# EAGLE design teensy-cv (EAGLE 7.4.0)
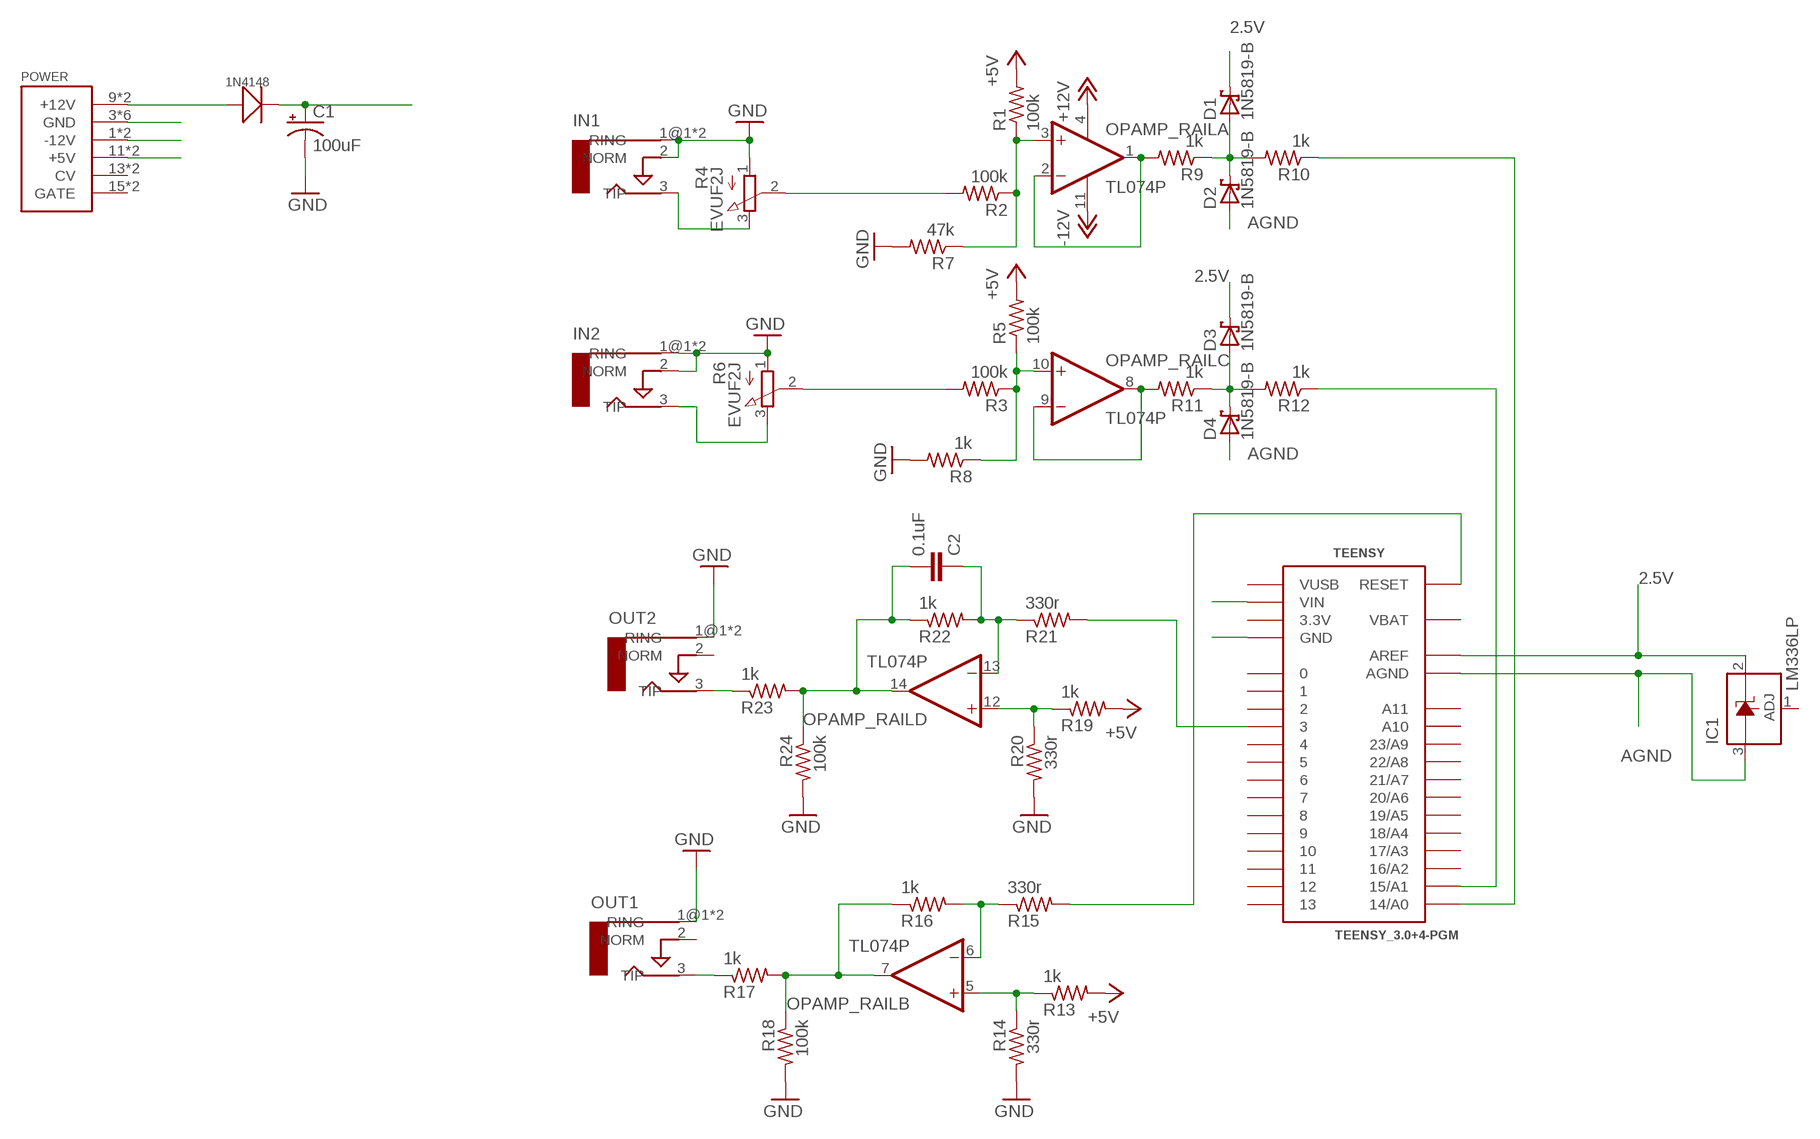
[diagram p0: schematic, sheet 1]

## Parts
1N4148  DIODE'1N4148'  [DO-35]
C1  100uF  CPOL-USE2-4  [E2-4]
C2  0.1uF  C5/3  [C5B3]
D1  1N5819-B  [DO41-7.6]
D2  1N5819-B  [DO41-7.6]
D3  1N5819-B  [DO41-7.6]
D4  1N5819-B  [DO41-7.6]
IC1  LM336LP  [TO92]
IN1  AUDIO-JACKERTHENVAR  [ERTHENVAR-JACK]
IN2  AUDIO-JACKERTHENVAR  [ERTHENVAR-JACK]
OPAMP_RAIL  TL074P  [DIL14]
OUT1  AUDIO-JACKERTHENVAR  [ERTHENVAR-JACK]
OUT2  AUDIO-JACKERTHENVAR  [ERTHENVAR-JACK]
POWER  POWER  [POWER_16]
R1  100k  R-US_0207/7  [0207/7]
R2  100k  R-US_0207/7  [0207/7]
R3  100k  R-US_0207/7  [0207/7]
R4  EVUF2J  [EVUFXJ]
R5  100k  R-US_0207/7  [0207/7]
R6  EVUF2J  [EVUFXJ]
R7  47k  R-US_0207/7  [0207/7]
R8  1k  R-US_0207/7  [0207/7]
R9  1k  R-US_0207/7  [0207/7]
R10  1k  R-US_0207/7  [0207/7]
R11  1k  R-US_0207/7  [0207/7]
R12  1k  R-US_0207/7  [0207/7]
R13  1k  R-US_0207/7  [0207/7]
R14  330r  R-US_0207/7  [0207/7]
R15  330r  R-US_0207/7  [0207/7]
R16  1k  R-US_0207/7  [0207/7]
R17  1k  R-US_0207/7  [0207/7]
R18  100k  R-US_0207/7  [0207/7]
R19  1k  R-US_0207/7  [0207/7]
R20  330r  R-US_0207/7  [0207/7]
R21  330r  R-US_0207/7  [0207/7]
R22  1k  R-US_0207/7  [0207/7]
R23  1k  R-US_0207/7  [0207/7]
R24  100k  R-US_0207/7  [0207/7]
TEENSY  TEENSY_3.0+4-PGM  [TEENSY_3.0+4-PGM]

## Nets
1N4148: 1N4148.A(+) POWER.9(+12V) POWER.10(+12V)
2.5V: D1.C D3.C IC1.2(C) TEENSY.AREF
+5V: POWER.11(+5V) POWER.12(+5V) R1.2 R5.2 R13.2 R19.2 TEENSY.VIN
+12V: 1N4148.C(-) C1.+ OPAMP_RAIL.4(P:V+)
-12V: OPAMP_RAIL.11(P:V-) POWER.1(-12V) POWER.2(-12V)
AGND: D2.A D4.A IC1.3(A) TEENSY.AGND
GND: C1.- IN1.1@1(RING) IN1.1@2(RING) IN1.2(NORM) IN2.1@1(RING) IN2.1@2(RING) IN2.2(NORM) OUT1.1@1(RING) OUT1.1@2(RING) OUT2.1@1(RING) OUT2.1@2(RING) POWER.3(GND) POWER.4(GND) POWER.5(GND) POWER.6(GND) POWER.7(GND) POWER.8(GND) R4.1(A) R6.1(A) R7.2 R8.2 R14.2 R18.2 R20.2 R24.2 TEENSY.GND TEENSY.GND1(GND)
N$1: R2.2 R4.2(S)
N$2: OPAMP_RAIL.1(A:OUT) OPAMP_RAIL.2(A:-IN) R9.2
N$3: OPAMP_RAIL.3(A:+IN) R1.1 R2.1 R7.1
N$4: IN1.3(TIP) R4.3(E)
N$5: D1.A D2.C R9.1 R10.2
N$6: R10.1 TEENSY.14/A0
N$7: IN2.3(TIP) R6.3(E)
N$8: R3.2 R6.2(S)
N$9: OPAMP_RAIL.10(C:+IN) R3.1 R5.1 R8.1
N$10: OPAMP_RAIL.8(C:OUT) OPAMP_RAIL.9(C:-IN) R11.2
N$13: D3.A D4.C R11.1 R12.2
N$14: R12.1 TEENSY.15/A1
N$15: OPAMP_RAIL.5(B:+IN) R13.1 R14.1
N$16: OPAMP_RAIL.6(B:-IN) R15.1 R16.2
N$17: OPAMP_RAIL.7(B:OUT) R16.1 R17.2 R18.1
N$18: OPAMP_RAIL.12(D:+IN) R19.1 R20.1
N$19: R15.2 TEENSY.RESET
N$20: OUT1.3(TIP) R17.1
N$21: C2.1 OPAMP_RAIL.13(D:-IN) R21.1 R22.2
N$22: C2.2 OPAMP_RAIL.14(D:OUT) R22.1 R23.2 R24.1
N$23: R21.2 TEENSY.3
N$24: OUT2.3(TIP) R23.1
Unconnected: IC1.1(ADJ) OUT1.2(NORM) OUT2.2(NORM) POWER.13(CV) POWER.14(CV) POWER.15(GATE) POWER.16(GATE) TEENSY.0 TEENSY.1 TEENSY.2 TEENSY.4 TEENSY.5 TEENSY.6 TEENSY.7 TEENSY.8 TEENSY.9 TEENSY.10 TEENSY.11 TEENSY.12 TEENSY.13 TEENSY.16/A2 TEENSY.17/A3 TEENSY.18/A4 TEENSY.19/A5 TEENSY.20/A6 TEENSY.21/A7 TEENSY.22/A8 TEENSY.23/A9 TEENSY.A10 TEENSY.A11

## Power pins joined to a net without a drawn wire
3.3V: TEENSY.3.3V TEENSY.3.3V1(3.3V)
VBAT: TEENSY.VBAT
VUSB: TEENSY.VUSB

## Library data of the parts
1N4148 = Seeed-OPL-Diode:DIODE*
C1 = rcl:CPOL-US: POLARIZED CAPACITOR, American symbol
C2 = capacitor-wima:C: CAPACITOR naming: grid - package width
D1-D4 = diode:1N581*: 1.0A SCHOTTKY BARRIER RECTIFIER Source: http://www.diodes.com/datasheets/ds23001.pdf
IC1 = linear:LM336: 2.5-V INTEGRATED REFERENCE CIRCUITS LM236 Source: http://focus.ti.com/lit/ds/symlink/lm336-2.5.pdf
IN1 IN2 OUT1 OUT2 = erthenvar:AUDIO-JACK: Switching Mono 3.5mm Audio Jack from Erthenvar.
OPAMP_RAIL = linear:TL074: OP AMP
POWER = eurorack:POWER
R1-R3 R5 R7-R24 = resistor:R-US_: RESISTOR, American symbol
R4 R6 = pot:EVU: 9 mm Square Rotary Potentiometers Source: Panasonic
TEENSY = Teensy3.0:TEENSY_3.0+4-PGM: Teensy 3.0 board outline identical to '+4' version except that the PGM pin has been omitted. See 'AllAnalogPins" and 'AllPins' packages for additional pin holes, as needed. The 'Basic' package has fewer pins

## Board
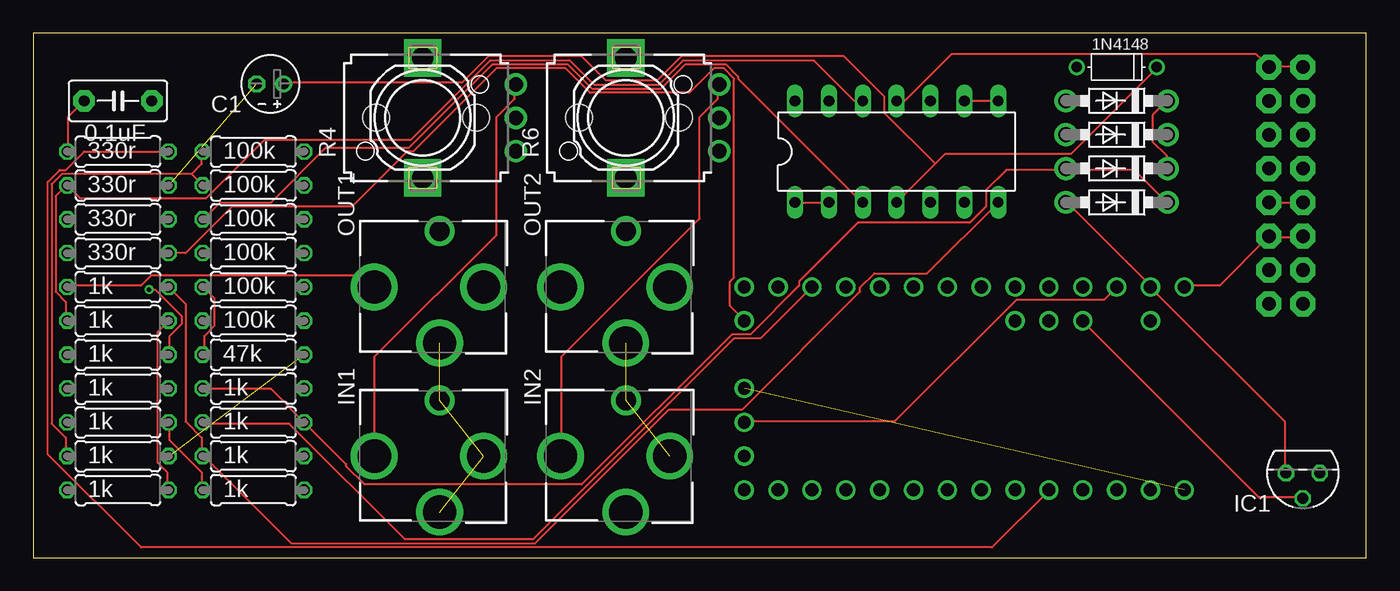
[diagram p1: board, top side]
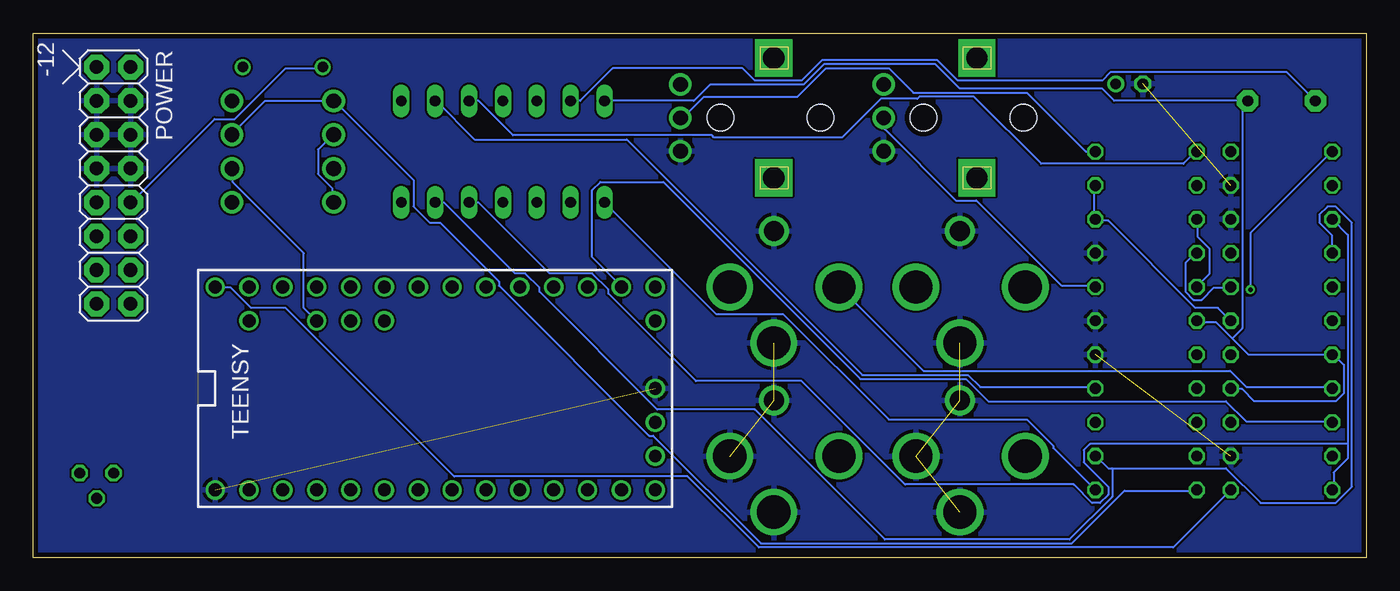
[diagram p2: board, bottom side, seen from below]

Size 100 x 39.36 mm. Coordinates in mm from the lower left corner, seen from the top.
Outline: 0,0 100,0 100,39.36 0,39.36 0,0
Copper layers (1*16): Top 0.0356mm / dielectric 1.5011mm / Bottom 0.0356mm
Design rules "LaenPCBOrder": minimum track width 6mil, minimum drill 13mil, track to track 6mil, track to pad 6mil, pad to pad 6mil, via to via 6mil, smd to smd 6mil, copper to edge 15mil, drill to drill 6mil, minimum pad ring 7mil, minimum via ring 7mil, stop-mask expansion 3mil, vias tented up to drill 0mil, thermal gap 10mil

### Footprints (pad centres in the part's own frame; a part is rotated, then mirrored left to right if it is on the bottom)
DO-35 = drill 0.8: A -3,0; C 3,0
E2-4 = drill 0.813 pad 1.27: + -1.016,0 | drill 0.813 pad 1.27 octagon: - 1.016,0
C5B3 = drill 0.813 pad 1.6 octagon: 1 -2.54,0; 2 2.54,0
DO41-7.6 = drill 1.1 pad 1.7: A 3.81,0; C -3.81,0
TO92 = drill 0.813 octagon: 1 -1.27,0; 2 0,1.905; 3 1.27,0
ERTHENVAR-JACK = drill 2.5: 1@1 -4.2,0; 2 0,-3.3; 3 0,4.9 | drill 1.5: 1@2 4.2,0
DIL14 = drill 0.813 long: 1 -7.62,-3.81; 2 -5.08,-3.81; 3 -2.54,-3.81; 4 0,-3.81; 5 2.54,-3.81; 6 5.08,-3.81; 7 7.62,-3.81; 8 7.62,3.81; 9 5.08,3.81; 10 2.54,3.81; 11 0,3.81; 12 -2.54,3.81; 13 -5.08,3.81; 14 -7.62,3.81
POWER_16 = drill 1.016 pad 1.88 octagon: 1 -6.35,-1.27; 2 -6.35,1.27; 3 -3.81,-1.27; 4 -3.81,1.27; 5 -1.27,-1.27; 6 -1.27,1.27; 7 1.27,-1.27; 8 1.27,1.27; 9 3.81,-1.27; 10 3.81,1.27; 11 6.35,-1.27; 12 6.35,1.27; 13 8.89,-1.27; 14 8.89,1.27; 15 11.43,-1.27; 16 11.43,1.27
0207/7 = drill 0.813 octagon: 1 -3.81,0; 2 3.81,0
EVUFXJ = drill 1.1 pad 1.676: 1 -2.5,-7; 2 0,-7; 3 2.5,-7 | drill 1.6 pad 2.8 square: M1 4.5,0; M2 -4.5,0 | hole 2: 0,3.5; 0,-4
TEENSY_3.0+4-PGM = drill 0.965: 0 -7.62,13.97; 1 -7.62,11.43; 2 -7.62,8.89; 3 -7.62,6.35; 3.3V 7.62,11.43; 3.3V1 -2.54,-16.51; 4 -7.62,3.81; 5 -7.62,1.27; 6 -7.62,-1.27; 7 -7.62,-3.81; 8 -7.62,-6.35; 9 -7.62,-8.89; 10 -7.62,-11.43; 11 -7.62,-13.97; 12 -7.62,-16.51; 13 7.62,-16.51; 14/A0 7.62,-13.97; 15/A1 7.62,-11.43; 16/A2 7.62,-8.89; 17/A3 7.62,-6.35; 18/A4 7.62,-3.81; 19/A5 7.62,-1.27; 20/A6 7.62,1.27; 21/A7 7.62,3.81; 22/A8 7.62,6.35; 23/A9 7.62,8.89; A10 5.08,6.35; A11 5.08,3.81; AGND 7.62,13.97; AREF 5.08,8.89; GND -7.62,16.51; GND1 0,-16.51; RESET 5.08,-16.51; VBAT -5.08,-16.51; VIN 7.62,16.51; VUSB 5.08,13.97

### Placement (x,y rotation side)
1N4148  81.28,36.83 0 top
C1  17.78,35.56 180 top
C2  6.35,34.29 0 top
D1  81.28,34.29 180 top
D2  81.28,31.75 180 top
D3  81.28,29.21 180 top
D4  81.28,26.67 180 top
IC1  95.25,6.35 180 top
IN1  30.48,7.62 90 top
IN2  44.45,7.62 90 top
OPAMP_RAIL  64.77,30.48 0 top
OUT1  30.48,20.32 90 top
OUT2  44.45,20.32 90 top
POWER  93.98,30.48 270 bottom
R1  16.51,25.4 0 top
R2  16.51,20.32 0 top
R3  16.51,30.48 0 top
R4  29.21,33.02 90 top
R5  16.51,27.94 0 top
R6  44.45,33.02 90 top
R7  16.51,15.24 0 top
R8  6.35,7.62 0 top
R9  16.51,5.08 0 top
R10  6.35,10.16 0 top
R11  16.51,12.7 0 top
R12  16.51,10.16 0 top
R13  6.35,5.08 0 top
R14  6.35,25.4 0 top
R15  6.35,22.86 0 top
R16  16.51,7.62 0 top
R17  6.35,20.32 0 top
R18  16.51,22.86 0 top
R19  6.35,17.78 0 top
R20  6.35,27.94 0 top
R21  6.35,30.48 0 top
R22  6.35,15.24 0 top
R23  6.35,12.7 0 top
R24  16.51,17.78 0 top
TEENSY  69.85,12.7 90 bottom

### Tracks (layer width: path | path; a pad name or v marks a point on that pad's centre or on a via)
1N4148
  Top 0.152: POWER.10 POWER.9
  Bottom 0.152: 1N4148.A 78.33,36.73 81.08,36.73 84.89,32.92 86.41,32.92 92.66,26.67 POWER.10
2.5V
  Top 0.152: D3.C 85.04,29.26 85.04,30.18 83.97,31.24 83.97,33.22 85.04,34.29 D1.C | IC1.2 95.25,4.57 91.9,4.57 78.79,17.68 TEENSY.AREF
  Bottom 0.152: TEENSY.AREF 79.7,18.75 79.7,22.86 85.04,28.19 85.04,29.11 D3.C
3.3V
  Top 0.152: TEENSY.3.3V 80.31,19.36 73.76,19.36 64.62,10.21 53.34,10.21 TEENSY.3.3V1
+5V
  Top 0.152: TEENSY.VIN 86.41,20.42 89,20.42 POWER.12 92.81,24.08 95.25,24.08 POWER.11 | R19.2 9.3,16.92 9.3,7.16 10.06,6.4 10.06,5.18 R13.2
  Bottom 0.152: R5.2 20.42,27.89 20.42,25.45 R1.2 20.27,25.3 19.36,25.3 12.8,18.75 11.12,18.75 R19.2 | R13.2 14.48,0.76 45.57,0.76 50.9,6.1 68.43,6.1 81.08,18.75 83.67,18.75 85.19,20.27 86.26,20.27 TEENSY.VIN
+12V
  Top 0.152: OPAMP_RAIL.4 67.67,29.57 | 67.67,29.57 68.43,30.33 77.88,30.33 84.28,36.73 1N4148.C | 67.67,29.57 63.86,33.38 63.86,34.59 60.81,37.64 48.62,37.64 46.79,35.81 42.98,35.81 41.15,37.64 34.14,37.64 32.16,35.66 18.9,35.66 C1.+
-12V
  Top 0.152: OPAMP_RAIL.11 65.38,34.29 68.89,37.8 91.75,37.8 POWER.2 92.81,36.88 95.25,36.88 POWER.1
AGND
  Top 0.152: IC1.3 93.88,6.4 93.88,10.21 83.82,20.27 TEENSY.AGND 83.82,20.42 77.57,26.67 D4.A
  Bottom 0.152: D4.A 77.57,26.67 77.57,27.74 78.64,28.8 78.64,30.63 77.57,31.7 D2.A
GND  (8 unrouted)
  pour Bottom: 0,0 0,40.64 100.33,40.64 100.33,0
N$1
  Bottom 0.152: R2.2 20.42,20.42 22.86,20.42 29.26,26.82 30.79,26.82 36.12,32.16 36.12,32.92 R4.2
N$2
  Top 0.152: OPAMP_RAIL.1 OPAMP_RAIL.2
  Bottom 0.152: R9.2 23.47,8.23 23.47,8.38 25.45,10.36 35.81,10.36 43.74,18.29 48.77,18.29 OPAMP_RAIL.1
N$3
  Top 0.152: R7.1 12.8,15.24 12.8,16.61 13.56,17.37 13.56,19.51 12.8,20.27 R2.1 | OPAMP_RAIL.3 62.18,26.67 52.88,35.97 52.88,36.12 51.97,37.03 48.92,37.03 47.09,35.2 41.91,35.2 40.08,37.03 34.44,37.03 28.19,30.79 21.95,30.79 17.83,26.67 14.02,26.67 12.8,25.45 R1.1
  Bottom 0.152: R1.1 12.65,25.3 12.65,24.08 11.73,23.16 11.73,21.34 12.65,20.42 R2.1
N$4
  Top 0.152: R4.3 36.12,35.51 36.12,34.44 34.75,33.07 34.75,24.23 25.6,15.09 25.6,7.62 IN1.3
N$5
  Top 0.152: R9.1 12.65,5.18 12.65,6.4 10.21,8.84 10.21,10.06 R10.2
  Bottom 0.152: D2.C 85.04,31.85 82.6,34.29 D1.A 77.42,34.29 71.48,28.35 71.48,26.36 70.26,25.15 69.49,25.15 65.08,20.73 65.08,20.42 53.8,9.14 53.49,9.14 45.41,1.07 22.1,1.07 18.14,5.03 12.8,5.03 R9.1
N$6
  Bottom 0.152: R10.1 2.59,10.21 8.99,10.21 10.52,11.73 28.35,11.73 30.02,13.41 37.95,13.41 52.73,28.19 57.45,28.19 58.06,27.58 58.06,22.55 55.93,20.42 TEENSY.14/A0
N$7
  Top 0.152: R6.3 51.36,35.51 51.36,34.44 49.99,33.07 49.99,25.45 39.62,15.09 39.62,7.62 IN2.3
N$8
  Bottom 0.152: R3.2 21.03,30.48 25.45,34.9 33.98,34.9 35.81,36.73 40.54,36.73 42.67,34.59 49.68,34.59 51.36,32.92 R6.2
N$9
  Top 0.152: 11.89,28.8 2.13,28.8 1.37,28.04 1.37,10.06 2.44,8.99 2.44,7.62 R8.1 | 11.89,28.8 12.65,28.04 R5.1 | 11.89,28.8 12.65,29.57 12.65,30.48 R3.1
  Bottom 0.152: OPAMP_RAIL.10 66.6,34.29 64.01,31.7 49.07,31.7 48.92,31.55 39.32,31.55 36.42,34.44 33.68,34.44 33.53,34.59 29.41,34.59 24.38,29.57 13.72,29.57 12.8,30.48 R3.1
N$10
  Top 0.152: OPAMP_RAIL.9 OPAMP_RAIL.8
  Bottom 0.152: R11.2 20.42,12.8 28.96,12.8 29.87,13.72 37.8,13.72 55.47,31.39 66.9,31.39 69.8,34.29 OPAMP_RAIL.9
N$13
  Top 0.152: R11.1 12.8,12.65 17.83,12.65 R12.2 23.47,7.01 23.47,6.86 24.84,5.49 41.15,5.49 52.43,16.76 53.8,16.76 57.45,20.42 57.45,20.73 61.87,25.15 70.26,25.15 71.48,26.36 71.48,27.58 73,29.11 77.42,29.11 D3.A 77.57,29.11 82.6,29.11 85.04,26.67 D4.C
N$14
  Top 0.152: TEENSY.15/A1 54.56,16.46 52.58,16.46 37.49,1.37 27.89,1.37 19.2,10.06 12.8,10.06 R12.1
N$15
  Bottom 0.152: 1.37,8.53 1.37,24.23 R14.1 | 1.37,8.53 1.37,7.47 2.44,6.4 2.44,5.18 R13.1 | OPAMP_RAIL.5 66.6,26.67 61.27,21.34 58.06,21.34 56.84,20.12 56.84,19.81 50.29,13.26 42.37,13.26 34.59,5.49 21.95,5.49 20.57,4.12 19.96,4.12 19.36,4.72 19.36,5.33 21.18,7.16 21.18,8.08 20.73,8.53 1.37,8.53
N$16
  Bottom 0.152: 19.05,6.71 19.36,6.71 20.27,7.62 R16.2 | 19.05,6.71 10.52,6.71 7.92,4.12 2.29,4.12 1.07,5.33 1.07,25.15 2.29,26.36 2.9,26.36 3.5,25.76 3.5,25.15 2.59,24.23 2.59,22.86 R15.1 | OPAMP_RAIL.6 69.19,26.67 63.86,21.34 63.09,21.34 62.03,20.27 62.03,19.96 53.19,11.12 45.87,11.12 36.12,1.37 22.25,1.37 19.05,4.57 19.05,6.71
N$17
  Top 0.152: R17.2 11.43,19.05 11.43,10.21 12.65,8.99 12.65,7.62 R16.1 12.8,7.62 19.36,1.07 37.64,1.07 47.7,11.12 53.19,11.12 62.03,19.96 62.03,20.27 63.09,21.34 67.06,21.34 OPAMP_RAIL.7
  Bottom 0.152: R17.2 10.21,20.27 11.43,20.27 12.34,19.36 12.95,19.36 13.56,19.96 13.56,22.1 12.8,22.86 R18.1
N$18
  Top 0.152: R19.1 2.44,17.83 2.44,19.2 1.68,19.96 1.68,27.13 2.44,27.89 R20.1 3.5,26.98 12.95,26.98 17.37,31.39 28.35,31.39 34.29,37.34 40.23,37.34 42.06,35.51 46.94,35.51 48.77,37.34 58.52,37.34 61.57,34.29 OPAMP_RAIL.12
N$19
  Top 0.152: R15.2 11.43,22.86 14.94,26.36 23.93,26.36 28.04,30.48 28.5,30.48 34.75,36.73 39.93,36.73 41.76,34.9 49.23,34.9 51.05,36.73 51.82,36.73 52.58,35.97 52.58,21.03 52.27,20.73 52.27,18.9 53.34,17.83 TEENSY.RESET
N$20
  Top 0.152: R17.1 2.59,20.42 8.08,20.42 8.84,21.18 24.69,21.18 25.45,20.42 OUT1.3
N$21  (via drill 0.33)
  Top 0.152: C2.1 2.59,33.07 2.59,30.48 R21.1 | v8.69,20.12 9.14,20.12 11.12,18.14 11.12,17.53 10.21,16.61 10.21,15.24 R22.2
  Bottom 0.152: v8.69,20.12 8.69,24.38 2.59,30.48 R21.1 | OPAMP_RAIL.13 58.98,34.29 56.54,36.73 46.79,36.73 45.87,35.81 42.37,35.81 40.84,37.34 32.16,37.34 30.63,35.81 19.81,35.81 19.2,36.42 5.94,36.42 C2.1
N$22
  Bottom 0.152: 10.06,16.46 11.28,17.68 12.65,17.68 R24.1 | 10.06,16.46 8.84,15.24 R22.1 2.44,15.24 1.68,14.48 1.68,12.34 2.29,11.73 8.38,11.73 9.3,12.65 10.06,12.65 R23.2 | OPAMP_RAIL.14 50.44,34.29 49.23,35.51 42.22,35.51 40.69,37.03 32.31,37.03 30.48,35.2 19.81,35.2 18.9,34.29 9.3,34.29 | 9.3,34.29 C2.2 8.99,34.29 | 10.06,16.46 9.3,17.22 9.3,34.29
N$23
  Top 0.152: R21.2 3.81,30.48 2.44,29.11 1.98,29.11 1.07,28.19 1.07,7.77 8.08,0.76 71.93,0.76 76.2,5.03 TEENSY.3
N$24
  Bottom 0.152: R23.1 2.59,12.8 8.99,12.8 10.21,14.02 33.22,14.02 39.47,20.27 OUT2.3